# EAGLE schematic filternetwork (EAGLE 8.1.0)
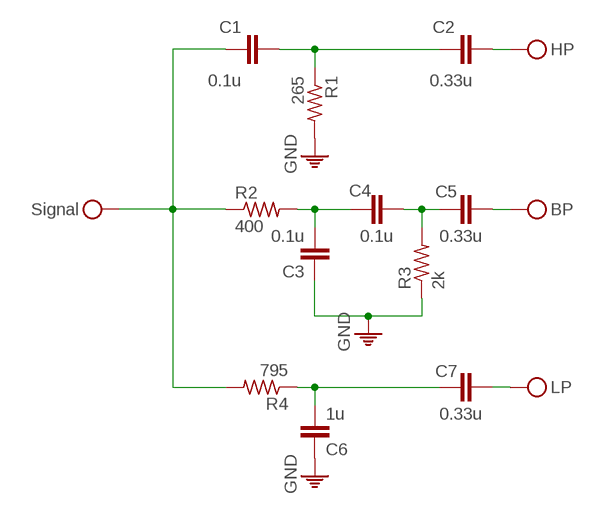
[diagram p0: schematic, sheet 1]

## Parts
C1  0.1u  C-EUC1206  [C1206]
C2  0.33u  C-EUC1206  [C1206]
C3  0.1u  C-EUC1206  [C1206]
C4  0.1u  C-EUC1206  [C1206]
C5  0.33u  C-EUC1206  [C1206]
C6  1u  C-EUC1206  [C1206]
C7  0.33u  C-EUC1206  [C1206]
R1  265  R-US_R1206  [R1206]
R2  400  R-US_R1206  [R1206]
R3  2k  R-US_R1206  [R1206]
R4  795  R-US_R1206  [R1206]

## Nets
GND: C3.1 C6.1 R1.2 R3.1
N$1: C1.2 C2.1 R1.1
N$2: C3.2 C4.2 R2.2
N$3: C4.1 C5.2 R3.2
N$4: C6.2 C7.2 R4.1
SIGIN: C1.1 R2.1 R4.2 ; supply symbol labelled Signal
VPP: C2.2 C5.1 C7.1 ; supply symbol labelled HP, BP, LP

## Library data of the parts
C1-C7 = rcl:C-EU: CAPACITOR, European symbol
R1-R4 = rcl:R-US_: RESISTOR, American symbol